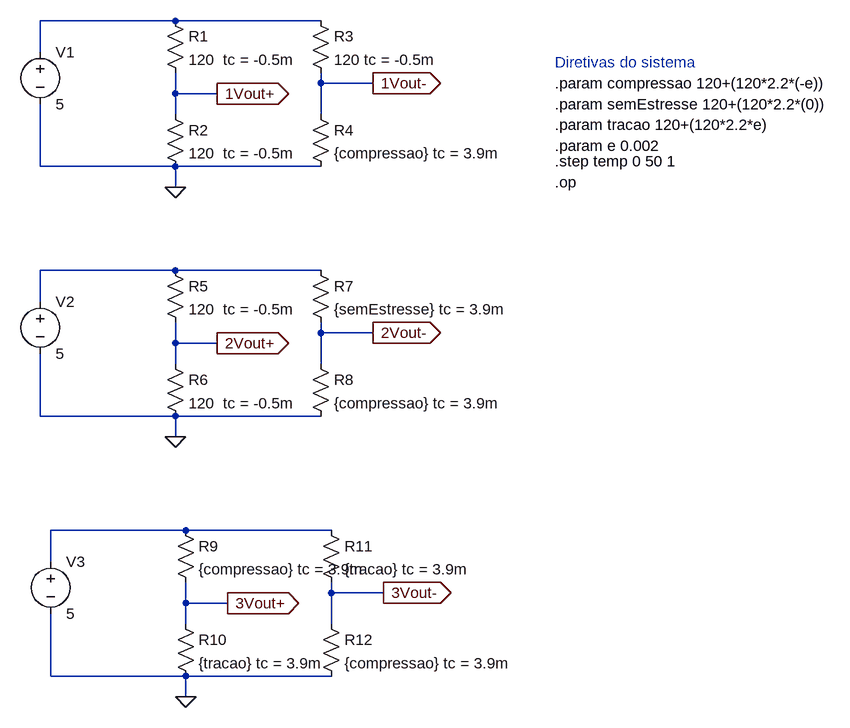
[diagram p0: schematic questaoB_P2.asc]
questaoB_P2.asc, the LTspice schematic file:
Version 4
SHEET 1 1024 976
WIRE -32 -128 -240 -128
WIRE 192 -128 -32 -128
WIRE -240 -80 -240 -128
WIRE 192 -32 192 -48
WIRE 272 -32 192 -32
WIRE -32 -16 -32 -48
WIRE 32 -16 -32 -16
WIRE -32 16 -32 -16
WIRE 192 16 192 -32
WIRE -240 96 -240 0
WIRE -32 96 -240 96
WIRE 192 96 -32 96
WIRE -32 128 -32 96
WIRE -32 256 -240 256
WIRE 192 256 -32 256
WIRE -240 304 -240 256
WIRE 192 352 192 336
WIRE 272 352 192 352
WIRE -32 368 -32 336
WIRE 32 368 -32 368
WIRE -32 400 -32 368
WIRE 192 400 192 352
WIRE -240 480 -240 384
WIRE -32 480 -240 480
WIRE 192 480 -32 480
WIRE -32 512 -32 480
WIRE -16 656 -224 656
WIRE 208 656 -16 656
WIRE -224 704 -224 656
WIRE 208 752 208 736
WIRE 288 752 208 752
WIRE -16 768 -16 736
WIRE 48 768 -16 768
WIRE -16 800 -16 768
WIRE 208 800 208 752
WIRE -224 880 -224 784
WIRE -16 880 -224 880
WIRE 208 880 -16 880
WIRE -16 912 -16 880
FLAG 32 -16 1Vout+
IOPIN 32 -16 Out
FLAG 32 368 2Vout+
IOPIN 32 368 Out
FLAG 48 768 3Vout+
IOPIN 48 768 Out
FLAG 272 -32 1Vout-
IOPIN 272 -32 Out
FLAG 272 352 2Vout-
IOPIN 272 352 Out
FLAG 288 752 3Vout-
IOPIN 288 752 Out
FLAG -32 128 0
FLAG -32 512 0
FLAG -16 912 0
SYMBOL voltage -240 -96 R0
WINDOW 123 0 0 Left 0
WINDOW 39 0 0 Left 0
SYMATTR InstName V1
SYMATTR Value 5
SYMBOL res -48 -144 R0
SYMATTR InstName R1
SYMATTR Value 120  tc = -0.5m
SYMBOL res -48 0 R0
SYMATTR InstName R2
SYMATTR Value 120  tc = -0.5m
SYMBOL res 176 -144 R0
SYMATTR InstName R3
SYMATTR Value 120 tc = -0.5m
SYMBOL res 176 0 R0
SYMATTR InstName R4
SYMATTR Value {compressao} tc = 3.9m
SYMBOL voltage -240 288 R0
WINDOW 123 0 0 Left 0
WINDOW 39 0 0 Left 0
SYMATTR InstName V2
SYMATTR Value 5
SYMBOL res -48 240 R0
SYMATTR InstName R5
SYMATTR Value 120  tc = -0.5m
SYMBOL res -48 384 R0
SYMATTR InstName R6
SYMATTR Value 120  tc = -0.5m
SYMBOL res 176 240 R0
SYMATTR InstName R7
SYMATTR Value {semEstresse} tc = 3.9m
SYMBOL res 176 384 R0
SYMATTR InstName R8
SYMATTR Value {compressao} tc = 3.9m
SYMBOL voltage -224 688 R0
WINDOW 123 0 0 Left 0
WINDOW 39 0 0 Left 0
SYMATTR InstName V3
SYMATTR Value 5
SYMBOL res -32 640 R0
SYMATTR InstName R9
SYMATTR Value {compressao} tc = 3.9m
SYMBOL res -32 784 R0
SYMATTR InstName R10
SYMATTR Value {tracao} tc = 3.9m
SYMBOL res 192 640 R0
SYMATTR InstName R11
SYMATTR Value {tracao} tc = 3.9m
SYMBOL res 192 784 R0
SYMATTR InstName R12
SYMATTR Value {compressao} tc = 3.9m
TEXT 552 64 Left 2 !.param e 0.002
TEXT 552 120 Left 2 !.op
TEXT 552 -32 Left 2 !.param compressao 120+(120*2.2*(-e))
TEXT 552 0 Left 2 !.param semEstresse 120+(120*2.2*(0))
TEXT 552 32 Left 2 !.param tracao 120+(120*2.2*e)
TEXT 552 88 Left 2 !.step temp 0 50 1
TEXT 552 -64 Left 2 ;Diretivas do sistema

The netlist it stands for:
* questaoB_P2.asc
V1 N001 0 5
R1 N001 1Vout+ 120  tc = -0.5m
R2 1Vout+ 0 120  tc = -0.5m
R3 N001 1Vout- 120 tc = -0.5m
R4 1Vout- 0 {compressao} tc = 3.9m
V2 N002 0 5
R5 N002 2Vout+ 120  tc = -0.5m
R6 2Vout+ 0 120  tc = -0.5m
R7 N002 2Vout- {semEstresse} tc = 3.9m
R8 2Vout- 0 {compressao} tc = 3.9m
V3 N003 0 5
R9 N003 3Vout+ {compressao} tc = 3.9m
R10 3Vout+ 0 {tracao} tc = 3.9m
R11 N003 3Vout- {tracao} tc = 3.9m
R12 3Vout- 0 {compressao} tc = 3.9m
.param e 0.002
.op
.param compressao 120+(120*2.2*(-e))
.param semEstresse 120+(120*2.2*(0))
.param tracao 120+(120*2.2*e)
.step temp 0 50 1
* Diretivas do sistema
.backanno
.end